# Altium schematic sheet beacon.SchDoc
size A; SheetNumber: 2; SheetTotal: 2
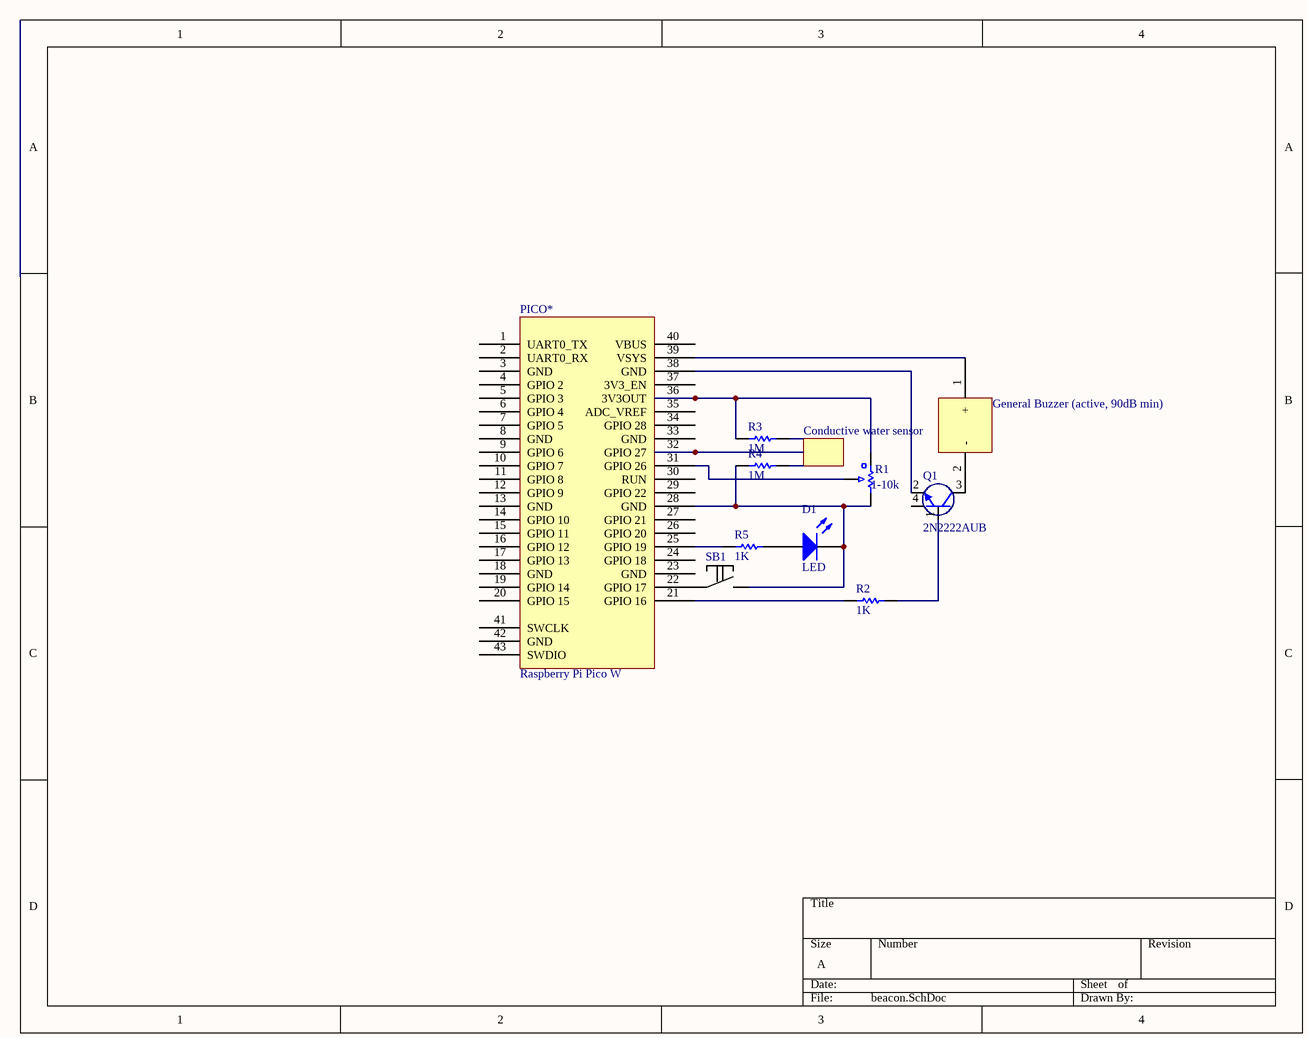
[diagram p0: beacon.SchDoc]

## Parts
D1  LED  [PCB-jf8qttwyjk8kzbl8ossh-1]
General_Buzzer_(active,_90dB_min)  (no value)  [PCB-xlh7dy84o8mtcso35ftk-1]
PICO*  Raspberry Pi Pico W  [Raspberry Pi RASPBERRY PI PICO W-Footprint-1]
Q1  2N2222AUB  [2N2222AUB-Footprint-1]
R1  1-10k  [PCB-37o3ncptyek4ffexthz2-1]
R2  1K  [0402-RES]
R3  1M  [0402-RES]
R4  1M  [0402-RES]
R5  1K  [0402-RES]
SB1  (no value)  [PCB-4tdpvsv0cagcn96pionj-1]

## Nets
NetD1_1: D1.1(A) R5.2
NetD1_2: D1.2(K) PICO*.28(GND) R1.3 R4.1 SB1.2
NetGeneral_Buzzer_(active,_90dB_min)_1: General_Buzzer_(active,_90dB_min).1(+) PICO*.39(VSYS)
NetGeneral_Buzzer_(active,_90dB_min)_2: General_Buzzer_(active,_90dB_min).2(-) Q1.3(C)
NetPICO*_21: PICO*.21(GPIO_16) R2.1
NetPICO*_25: PICO*.25(GPIO_19) R5.1
NetPICO*_31: PICO*.31(GPIO_26) R1.2
NetPICO*_36: PICO*.36(3V3OUT) R1.1 R3.1
NetPICO*_38: PICO*.38(GND) Q1.2(E)
NetQ1_1: Q1.1(B) R2.2

Not connected (* = marked no-connect by the designer): PICO* 1(UART0_TX) 2(UART0_RX) 3(GND) 4(GPIO_2) 5(GPIO_3) 6(GPIO_4) 7(GPIO_5) 8(GND) 9(GPIO_6) 10(GPIO_7) 11(GPIO_8) 12(GPIO_9) 13(GND) 14(GPIO_10) 15(GPIO_11) 16(GPIO_12) 17(GPIO_13) 18(GND) 19(GPIO_14) 20(GPIO_15) 22(GPIO_17) 23(GND) 24(GPIO_18) 26(GPIO_20) 27(GPIO_21) 29(GPIO_22) 30(RUN) 32(GPIO_27) 33(GND) 34(GPIO_28) 35(ADC_VREF) 37(3V3_EN) 40(VBUS) 41(SWCLK) 42(GND) 43(SWDIO); Q1 4(G); R3 2; R4 2; SB1 1

## Notes on the sheet
- Conductive water sensor

## Library data of the parts
D1 = CMP-b20d7b0713fb6dca-10: LED, Standard throughole Or 0603 SMA; OctopartID: b20d7b0713fb6dca; JLCPCB Part #: C2895470
General_Buzzer_(active,_90dB_min) = CMP-5fc196cb676b8006-6: Piezo Buzzer; Supply Voltage (DC): 3.00 V (min), 25.0 V (max); Frequency: 4.0 kHz; Lead-Free Status: Lead Free; Resonant Frequency: 3.60 kHz; OctopartID: 5fc196cb676b8006; Operating Temperature: 70.0 °C (max); RoHS: Compliant; Self Resonant Frequency: 4.0 kHz; Mounting Style: SMD; Packaging: Bulk; Size-Diameter: 9x9mm
PICO* = CMP-08cbc67d7343d70c-6: Raspberry Pi Board, Arm CORTEX-M0+;; Designator: PICO?; Mounting Style: Surface Mount; OctopartID: 08cbc67d7343d70c; Octopart Url: https://octopart.com/raspberry+pi+pico+w-raspberry+pi-129785582; Manufacturer Part Number: RASPBERRY PI PICO W
Q1 = CMP-07f4ce61b9a4d833-4: Small Signal Bipolar Transistor, 0.8A I(C), 50V V(BR)CEO, 1-Element, NPN, Silicon; OctopartID: 07f4ce61b9a4d833; Packaging: Pack; Lifecycle Status: Not Listed by Manufacturer; Manufacturer Part Number: 2N2222AUB; Octopart Url: https://octopart.com/jan2n2222aub-microchip-10459958; Mounting Style: Surface Mount
R1 = CMP-b3177a6863606cd0-2: Res Conductive Plastic POT 10K Ohm 20% 1/5W 1(Elec)/1(Mech)Turn 6mm Pin Panel Mount/Through Hole; Manufacturer: BI Technologies; Manufacturer Part Number: P160KN-0QC15B10K; Lead-Free Status: Lead Free; Packaging: Tray; OctopartID: b3177a6863606cd0; RoHS: Compliant; Octopart URL: http://octopart.com/p160kn-0qc15b10k-bi+technologies-7730449; Mounting Style: PCB, Panel
R2 R5 = CMP-1851410-3: RESISTOR, 0402, 1K, 0.1%, 0.063W; Manufacturer Part Number: ERA-2AEB102X; Lead-Free Status: Lead Free; Resistance: 1000.0 Ω; Voltage Rating (DC): 25.0 V; Case/Package: 0402; Lifecycle Status: Not Listed by Manufacturer; Number of Pins: 2; Octopart Url: https://octopart.com/era-2aeb102x-panasonic-9251385; OctopartID: b3377ab0bc686cf0; Packaging: Cut Tape (CT); Power Rating: 0.063 W; Resistance Tolerance: ±0.1%; RoHS: Compliant
R3 R4 = CMP-1851410-3: Manufacturer Part Number: ERA-2AEB102X; Lead-Free Status: Lead Free; Power Rating: 0.063 W; Resistance: 1000.0 Ω; Resistance Tolerance: ±0.1%; Voltage Rating (DC): 25.0 V; Case/Package: 0402; Lifecycle Status: Not Listed by Manufacturer; Number of Pins: 2; Octopart Url: https://octopart.com/era-2aeb102x-panasonic-9251385; OctopartID: b3377ab0bc686cf0; Packaging: Cut Tape (CT); RoHS: Compliant
SB1 = CMP-fbb930d55ed6247e-4: Black Button Tactile Switch, SPST 50 mA@ 24 V dc 1.24mm; Manufacturer Part Number: FSMRA2JH; Contacts Type: SPST-NO; Lead-Free Status: Lead Free; Insulation Resistance: 100 MΩ; ELV Compliant: Compliant; REACH SVHC Compliance: No SVHC; Contact Material: Copper Alloy; RoHS: Compliant; Octopart URL: http://octopart.com/fsmra2jh-te+connectivity+%2F+alcoswitch-40271881; Color: Black; Lifecycle Status: Obsolete; Mounting Style: Through Hole; Material: Nylon; Contact Plating: Silver; Packaging: Bulk; OctopartID: fbb930d55ed6247e